# Altium schematic sheet 智能家居-电灯.SchDoc
size A4
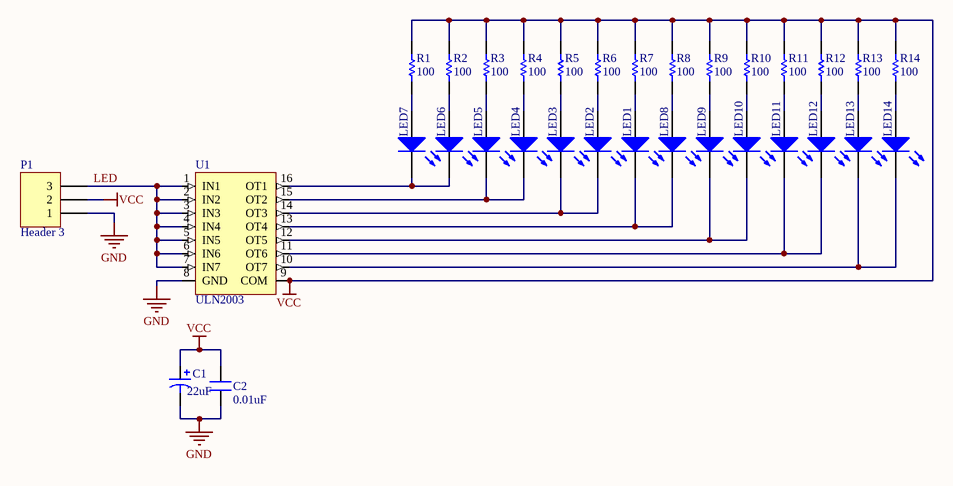
[diagram p0: 智能家居-电灯.SchDoc]

## Parts
C1  value 22uF  [CD5]  (hidden comment: Cap Pol1)
C2  0.01uF  [0.1UF]
LED1  LED0  [LED-3]  (value not drawn)
LED2  LED0  [LED-3]  (value not drawn)
LED3  LED0  [LED-3]  (value not drawn)
LED4  LED0  [LED-3]  (value not drawn)
LED5  LED0  [LED-3]  (value not drawn)
LED6  LED0  [LED-3]  (value not drawn)
LED7  LED0  [LED-3]  (value not drawn)
LED8  LED0  [LED-3]  (value not drawn)
LED9  LED0  [LED-3]  (value not drawn)
LED10  LED0  [LED-3]  (value not drawn)
LED11  LED0  [LED-3]  (value not drawn)
LED12  LED0  [LED-3]  (value not drawn)
LED13  LED0  [LED-3]  (value not drawn)
LED14  LED0  [LED-3]  (value not drawn)
P1  Header 3  [TJC3-3A]
R1  value 100  [AXIAL-0.3]  (hidden comment: Res1)
R2  value 100  [AXIAL-0.3]  (hidden comment: Res1)
R3  value 100  [AXIAL-0.3]  (hidden comment: Res1)
R4  value 100  [AXIAL-0.3]  (hidden comment: Res1)
R5  value 100  [AXIAL-0.3]  (hidden comment: Res1)
R6  value 100  [AXIAL-0.3]  (hidden comment: Res1)
R7  value 100  [AXIAL-0.3]  (hidden comment: Res1)
R8  value 100  [AXIAL-0.3]  (hidden comment: Res1)
R9  value 100  [AXIAL-0.3]  (hidden comment: Res1)
R10  value 100  [AXIAL-0.3]  (hidden comment: Res1)
R11  value 100  [AXIAL-0.3]  (hidden comment: Res1)
R12  value 100  [AXIAL-0.3]  (hidden comment: Res1)
R13  value 100  [AXIAL-0.3]  (hidden comment: Res1)
R14  value 100  [AXIAL-0.3]  (hidden comment: Res1)
U1  ULN2003  [DIP16]

## Nets
GND: C1.2 C2.1 P1.1 U1.8(GND)
VCC: C1.1 C2.2 P1.2 R1.2 R2.2 R3.2 R4.2 R5.2 R6.2 R7.2 R8.2 R9.2 R10.2 R11.2 R12.2 R13.2 R14.2 U1.9(COM)
LED: P1.3 U1.1(IN1) U1.2(IN2) U1.3(IN3) U1.4(IN4) U1.5(IN5) U1.6(IN6) U1.7(IN7)
NetLED1_1: LED1.1(A) R7.1
NetLED1_2: LED1.2(K) LED8.2(K) U1.13(OT4)
NetLED2_1: LED2.1(A) R6.1
NetLED2_2: LED2.2(K) LED3.2(K) U1.14(OT3)
NetLED3_1: LED3.1(A) R5.1
NetLED4_1: LED4.1(A) R4.1
NetLED4_2: LED4.2(K) LED5.2(K) U1.15(OT2)
NetLED5_1: LED5.1(A) R3.1
NetLED6_1: LED6.1(A) R2.1
NetLED6_2: LED6.2(K) LED7.2(K) U1.16(OT1)
NetLED7_1: LED7.1(A) R1.1
NetLED8_1: LED8.1(A) R8.1
NetLED9_1: LED9.1(A) R9.1
NetLED9_2: LED9.2(K) LED10.2(K) U1.12(OT5)
NetLED10_1: LED10.1(A) R10.1
NetLED11_1: LED11.1(A) R11.1
NetLED11_2: LED11.2(K) LED12.2(K) U1.11(OT6)
NetLED12_1: LED12.1(A) R12.1
NetLED13_1: LED13.1(A) R13.1
NetLED13_2: LED13.2(K) LED14.2(K) U1.10(OT7)
NetLED14_1: LED14.1(A) R14.1

## Library data of the parts
C1 = Cap Pol1: Polarized Capacitor (Radial); Published: 8-Jun-2000; LatestRevisionDate: 17-Jul-2002; LatestRevisionNote: Re-released for DXP Platform.; PackageReference: RB7.6-15; Publisher: Altium Limited; PackageDescription: Polarized Capacitor (Radial); 2 Leads
C2 = C
LED1-LED14 = LED0: Typical INFRARED GaAs LED; Published: 8-Jun-2000; LatestRevisionDate: 08-Jul-2005; LatestRevisionNote: Mech Layer 1 removed.; PackageReference: LED-0; Publisher: Altium Limited; PackageDescription: LED; 2 Leads
P1 = Header 3: Header, 3-Pin; LatestRevisionDate: 17-Jul-2002; LatestRevisionNote: Re-released for DXP Platform.; Publisher: Altium Limited
R1-R14 = Res1: Resistor; Published: 8-Jun-2000; LatestRevisionDate: 17-Jul-2002; LatestRevisionNote: Re-released for DXP Platform.; PackageReference: AXIAL-0.3; Publisher: Altium Limited; PackageDescription: Axial Device, Thru-Hole; 2 Leads; 0.3 in Pin Spacing